# Altium schematic sheet Bike_Light_PCB_2017_Front_LED.SchDoc
size A
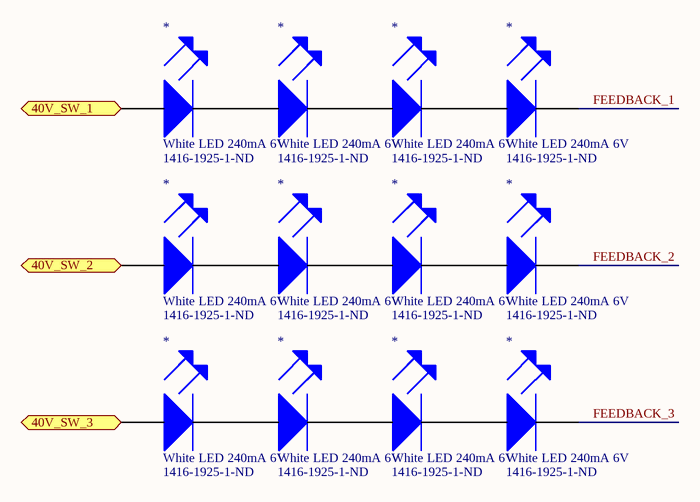
[diagram p0: Bike_Light_PCB_2017_Front_LED.SchDoc]

## Parts
(Parts that share a designator on the sheet are numbered #1, #2 ... from top to bottom, then left to right.)
*#1  White LED 240mA 6V  Supplier Part Number 1: 1416-1925-1-ND
*#2  White LED 240mA 6V  Supplier Part Number 1: 1416-1925-1-ND
*#3  White LED 240mA 6V  Supplier Part Number 1: 1416-1925-1-ND
*#4  White LED 240mA 6V  Supplier Part Number 1: 1416-1925-1-ND
*#5  White LED 240mA 6V  Supplier Part Number 1: 1416-1925-1-ND
*#6  White LED 240mA 6V  Supplier Part Number 1: 1416-1925-1-ND
*#7  White LED 240mA 6V  Supplier Part Number 1: 1416-1925-1-ND
*#8  White LED 240mA 6V  Supplier Part Number 1: 1416-1925-1-ND
*#9  White LED 240mA 6V  Supplier Part Number 1: 1416-1925-1-ND
*#10  White LED 240mA 6V  Supplier Part Number 1: 1416-1925-1-ND
*#11  White LED 240mA 6V  Supplier Part Number 1: 1416-1925-1-ND
*#12  White LED 240mA 6V  Supplier Part Number 1: 1416-1925-1-ND

## Ports
40V_SW_1 (in), 40V_SW_2 (in), 40V_SW_3 (in)

## Nets
40V_SW_1: *#1.2 ; port 40V_SW_1
40V_SW_2: *#5.2 ; port 40V_SW_2
40V_SW_3: *#9.2 ; port 40V_SW_3
FEEDBACK_1: *#4.3
FEEDBACK_2: *#8.3
FEEDBACK_3: *#12.3
Net*#1_3: *#1.3 *#2.2
Net*#2_3: *#2.3 *#3.2
Net*#3_3: *#3.3 *#4.2
Net*#5_3: *#5.3 *#6.2
Net*#6_3: *#6.3 *#7.2
Net*#7_3: *#7.3 *#8.2
Net*#9_3: *#9.3 *#10.2
Net*#10_3: *#10.3 *#11.2
Net*#11_3: *#11.3 *#12.2

## Library data of the parts
*#1-*#12 = White LED 240mA 6V: Supplier 1: Digi-Key